# Altium project Zumo LF v2.0.PrjPcb (part 1 of 3)
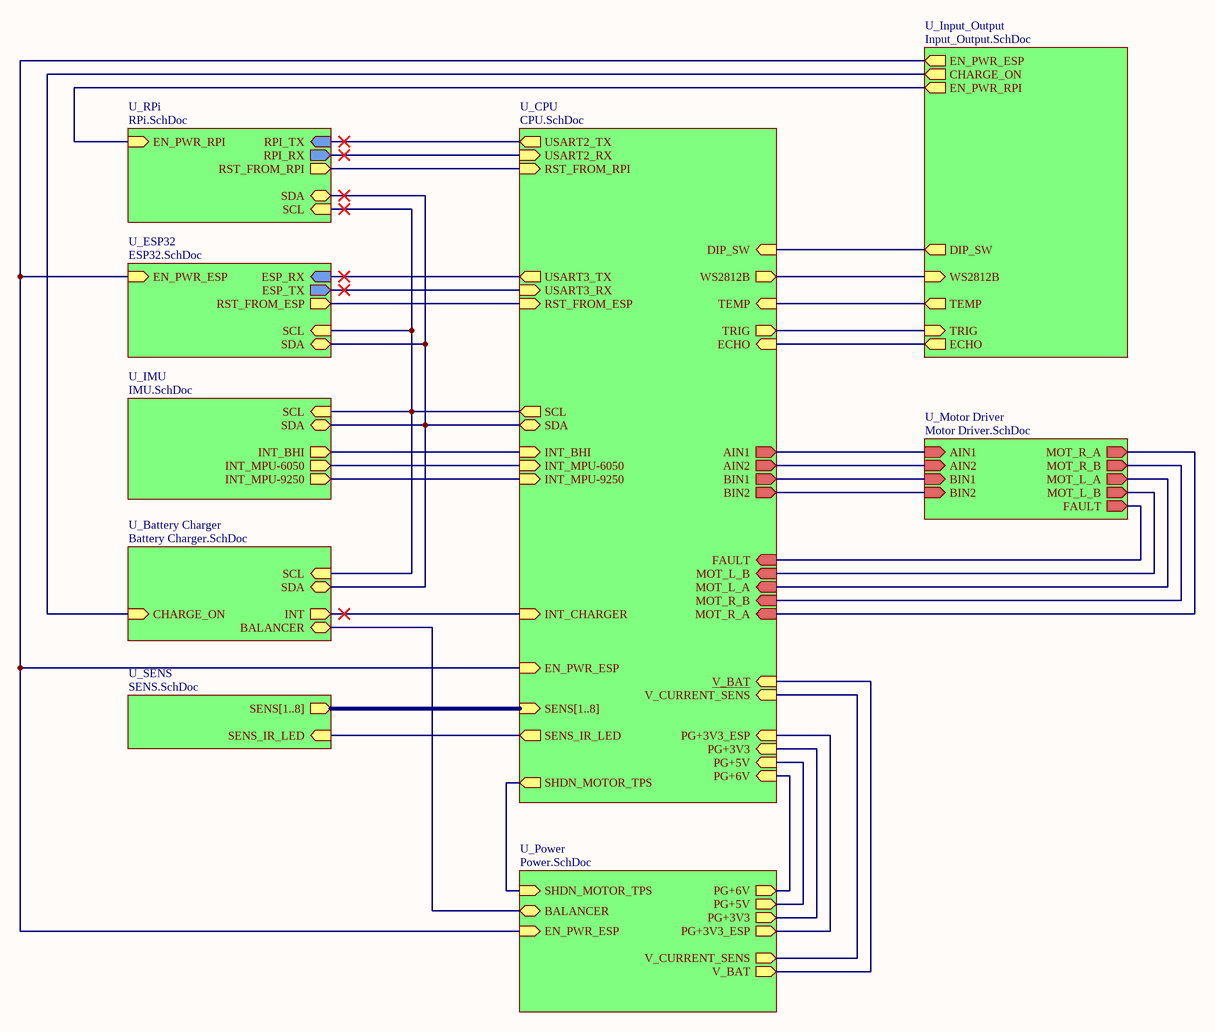
[diagram p0: Main.SchDoc]
10 sheets, 191 parts. Net scope: hierarchical (ports join the sheet entries above them; power ports are global).
Board file: Zumo LF v2.0.PcbDoc
Sheets:
  Main.SchDoc
    U_SENS = SENS.SchDoc
    U_Power = Power.SchDoc
    U_Motor Driver = Motor Driver.SchDoc
    U_CPU = CPU.SchDoc
    U_IMU = IMU.SchDoc
    U_ESP32 = ESP32.SchDoc
    U_RPi = RPi.SchDoc
    U_Input_Output = Input_Output.SchDoc
    U_Battery Charger = Battery Charger.SchDoc

## Sheet Main.SchDoc: Linefollower-Main
size A3; Author: Patryk Bujak; DrawnBy: Patryk Bujak; DocumentNumber: 12; Revision: 1.0; SheetNumber: 1; SheetTotal: 10

### Sub-sheets
U_Battery Charger = Battery Charger.SchDoc: SDA (bidir), SCL (in), CHARGE_ON (in), INT (out), BALANCER (bidir)
U_CPU = CPU.SchDoc: SENS[1..8] (in), SCL (out), SDA (bidir), INT_BHI (in), INT_MPU-9250 (in), INT_MPU-6050 (in), AIN2 (out), AIN1 (out), BIN1 (out), BIN2 (out), FAULT (in), MOT_R_B (in), MOT_R_A (in), MOT_L_B (in), MOT_L_A (in), SHDN_MOTOR_TPS (out), PG+3V3_ESP (in), PG+6V (in), PG+5V (in), PG+3V3 (in), SENS_IR_LED (out), TRIG (out), ECHO (in), TEMP (in), WS2812B (out), DIP_SW (in), V_CURRENT_SENS (in), V_BAT (in), EN_PWR_ESP (in), INT_CHARGER (in), RST_FROM_ESP (in), RST_FROM_RPI (in), USART2_TX (out), USART2_RX (in), USART3_RX (in), USART3_TX (out)
U_ESP32 = ESP32.SchDoc: ESP_TX (out), ESP_RX (in), EN_PWR_ESP (in), SDA (bidir), SCL (in), RST_FROM_ESP (out)
U_IMU = IMU.SchDoc: INT_BHI (out), INT_MPU-9250 (out), INT_MPU-6050 (out), SCL (in), SDA (bidir)
U_Input_Output = Input_Output.SchDoc: WS2812B (in), TRIG (in), ECHO (out), TEMP (out), CHARGE_ON (out), DIP_SW (out), EN_PWR_ESP (out), EN_PWR_RPI (out)
U_Motor Driver = Motor Driver.SchDoc: AIN2 (in), AIN1 (in), BIN1 (in), BIN2 (in), FAULT (out), MOT_R_B (out), MOT_R_A (out), MOT_L_B (out), MOT_L_A (out)
U_Power = Power.SchDoc: SHDN_MOTOR_TPS (in), PG+6V (out), PG+5V (out), PG+3V3 (out), PG+3V3_ESP (out), EN_PWR_ESP (in), V_CURRENT_SENS (out), V_BAT (out), BALANCER (bidir)
U_RPi = RPi.SchDoc: RPI_TX (in), RPI_RX (out), SDA (bidir), SCL (in), EN_PWR_RPI (in), RST_FROM_RPI (out)
U_SENS = SENS.SchDoc: SENS[1..8] (out), SENS_IR_LED (in)

### Nets
BCM2/SDA: sheet U_CPU/SDA, sheet U_IMU/SDA, sheet U_ESP32/SDA, sheet U_RPi/SDA, sheet U_Battery Charger/SDA
BCM3/SCL: sheet U_CPU/SCL, sheet U_IMU/SCL, sheet U_ESP32/SCL, sheet U_RPi/SCL, sheet U_Battery Charger/SCL
EN_PWR_RPI: sheet U_RPi/EN_PWR_RPI, sheet U_Input_Output/EN_PWR_RPI
PG+3V3: sheet U_Power/PG+3V3, sheet U_CPU/PG+3V3
PG+3V3_ESP: sheet U_Power/PG+3V3_ESP, sheet U_CPU/PG+3V3_ESP
PG+5V: sheet U_Power/PG+5V, sheet U_CPU/PG+5V
PG+6V: sheet U_Power/PG+6V, sheet U_CPU/PG+6V
RXD: sheet U_CPU/USART3_TX, sheet U_ESP32/ESP_RX
TXD: sheet U_CPU/USART3_RX, sheet U_ESP32/ESP_TX
WS2812B: sheet U_CPU/WS2812B, sheet U_Input_Output/WS2812B
NetC4_1: sheet U_CPU/TEMP, sheet U_Input_Output/TEMP
NetC6_1: sheet U_Power/V_CURRENT_SENS, sheet U_CPU/V_CURRENT_SENS
NetC22_1: sheet U_Power/V_BAT, sheet U_CPU/V_BAT
NetD8_1: sheet U_Motor Driver/FAULT, sheet U_CPU/FAULT
NetJ1_2: sheet U_Power/BALANCER, sheet U_Battery Charger/BALANCER
NetJ4_11: sheet U_SENS/SENS_IR_LED, sheet U_CPU/SENS_IR_LED
NetM1_24: sheet U_CPU/RST_FROM_ESP, sheet U_ESP32/RST_FROM_ESP
NetP4_4: sheet U_Motor Driver/MOT_L_A, sheet U_CPU/MOT_L_A
NetP4_5: sheet U_Motor Driver/MOT_L_B, sheet U_CPU/MOT_L_B
NetP5_4: sheet U_Motor Driver/MOT_R_A, sheet U_CPU/MOT_R_A
NetP5_5: sheet U_Motor Driver/MOT_R_B, sheet U_CPU/MOT_R_B
NetR7_1: sheet U_Power/SHDN_MOTOR_TPS, sheet U_CPU/SHDN_MOTOR_TPS
NetR10_2: sheet U_CPU/RST_FROM_RPI, sheet U_RPi/RST_FROM_RPI
NetR11_2: sheet U_Power/EN_PWR_ESP, sheet U_CPU/EN_PWR_ESP, sheet U_ESP32/EN_PWR_ESP, sheet U_Input_Output/EN_PWR_ESP
NetR60_1: sheet U_CPU/INT_CHARGER, sheet U_Battery Charger/INT
NetR61_1: sheet U_Input_Output/CHARGE_ON, sheet U_Battery Charger/CHARGE_ON
NetS1_7: sheet U_CPU/DIP_SW, sheet U_Input_Output/DIP_SW
NetU7_24: sheet U_CPU/INT_MPU-6050, sheet U_IMU/INT_MPU-6050
NetU7_26: sheet U_Motor Driver/AIN1, sheet U_CPU/AIN1
NetU7_27: sheet U_Motor Driver/AIN2, sheet U_CPU/AIN2
NetU7_29: sheet U_CPU/TRIG, sheet U_Input_Output/TRIG
NetU7_30: sheet U_CPU/ECHO, sheet U_Input_Output/ECHO
NetU7_34: sheet U_Motor Driver/BIN1, sheet U_CPU/BIN1
NetU7_35: sheet U_Motor Driver/BIN2, sheet U_CPU/BIN2
NetU7_53: sheet U_CPU/INT_BHI, sheet U_IMU/INT_BHI
NetU7_54: sheet U_CPU/INT_MPU-9250, sheet U_IMU/INT_MPU-9250
NetU7_55: sheet U_CPU/USART2_TX, sheet U_RPi/RPI_TX
NetU7_56: sheet U_CPU/USART2_RX, sheet U_RPi/RPI_RX

### Buses and harness runs
bus sheet U_CPU/SENS[1..8] = sheet U_SENS/SENS[1..8]

### Notes on the sheet
- Title:
- Sheet:
- of
- Author:
- Model:
- Document Number:
- Checked by:
- Iss-Rev:
- Approved by:
- Date:
- File name:

## Sheet SENS.SchDoc: Motherboard-SENS
size A4; Author: Patryk Bujak; DrawnBy: Patryk Bujak; DocumentNumber: 12; Revision: 1.0; SheetNumber: 2; SheetTotal: 10
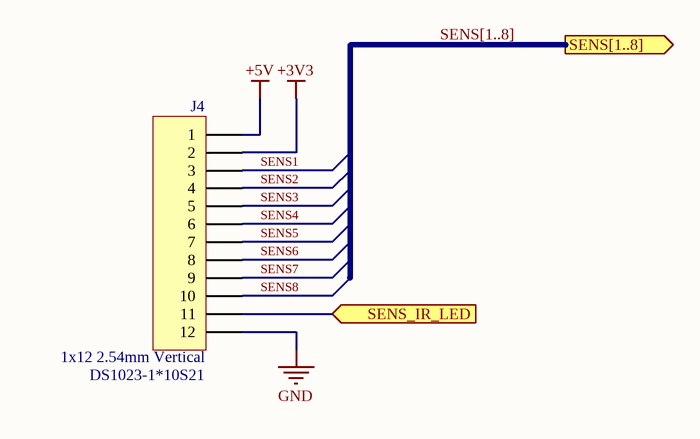
[diagram p1: SENS.SchDoc]

### Parts
J4  value DS1023-1*10S21  SCH_Footprint: 1x12 2.54mm Vertical  [J_HEADER_1x12_2.54_VERTICAL]  (hidden comment: Goldpin female straight)

### Ports
SENS[1..8] (out), SENS_IR_LED (in)

### Nets
+3V3: J4.2
+5V: J4.1
GND: J4.12
SENS1: J4.3
SENS2: J4.4
SENS3: J4.5
SENS4: J4.6
SENS5: J4.7
SENS6: J4.8
SENS7: J4.9
SENS8: J4.10
NetJ4_11: J4.11 ; port SENS_IR_LED

### Buses and harness runs
bus SENS[1..8] = port SENS[1..8]

### Notes on the sheet
- Title:
- Sheet:
- of
- Author:
- Model:
- Document Number:
- Checked by:
- Iss-Rev:
- Approved by:
- Date:
- File name:

### Library data of the parts
J4 = J_HEADER_1x12_2.54_VERTICAL: Header, 12-Pin; Manufacturer: Connfly; Part Number: J_HEADER_1x12_2.54_VERTICAL; Component Type: Standard; HelpURL: https://www.tme.eu/Document/efd0203e2d3a140765df98191085ea88/DS1023.pdf; Manufacturer Part Number: DS1023-1*10S21; Supplier 1: TME; Supplier Part Number 1: ZL262-10SG; Supplier 2: RS Components; Supplier 3: Farnell; Supplier 4: Mouser; Supplier 5: Digi-Key

## Sheet Power.SchDoc: Linefollower-Power
size A3; Author: Patryk Bujak; DrawnBy: Patryk Bujak; DocumentNumber: 12; Revision: 1.0; SheetNumber: 10; SheetTotal: 10
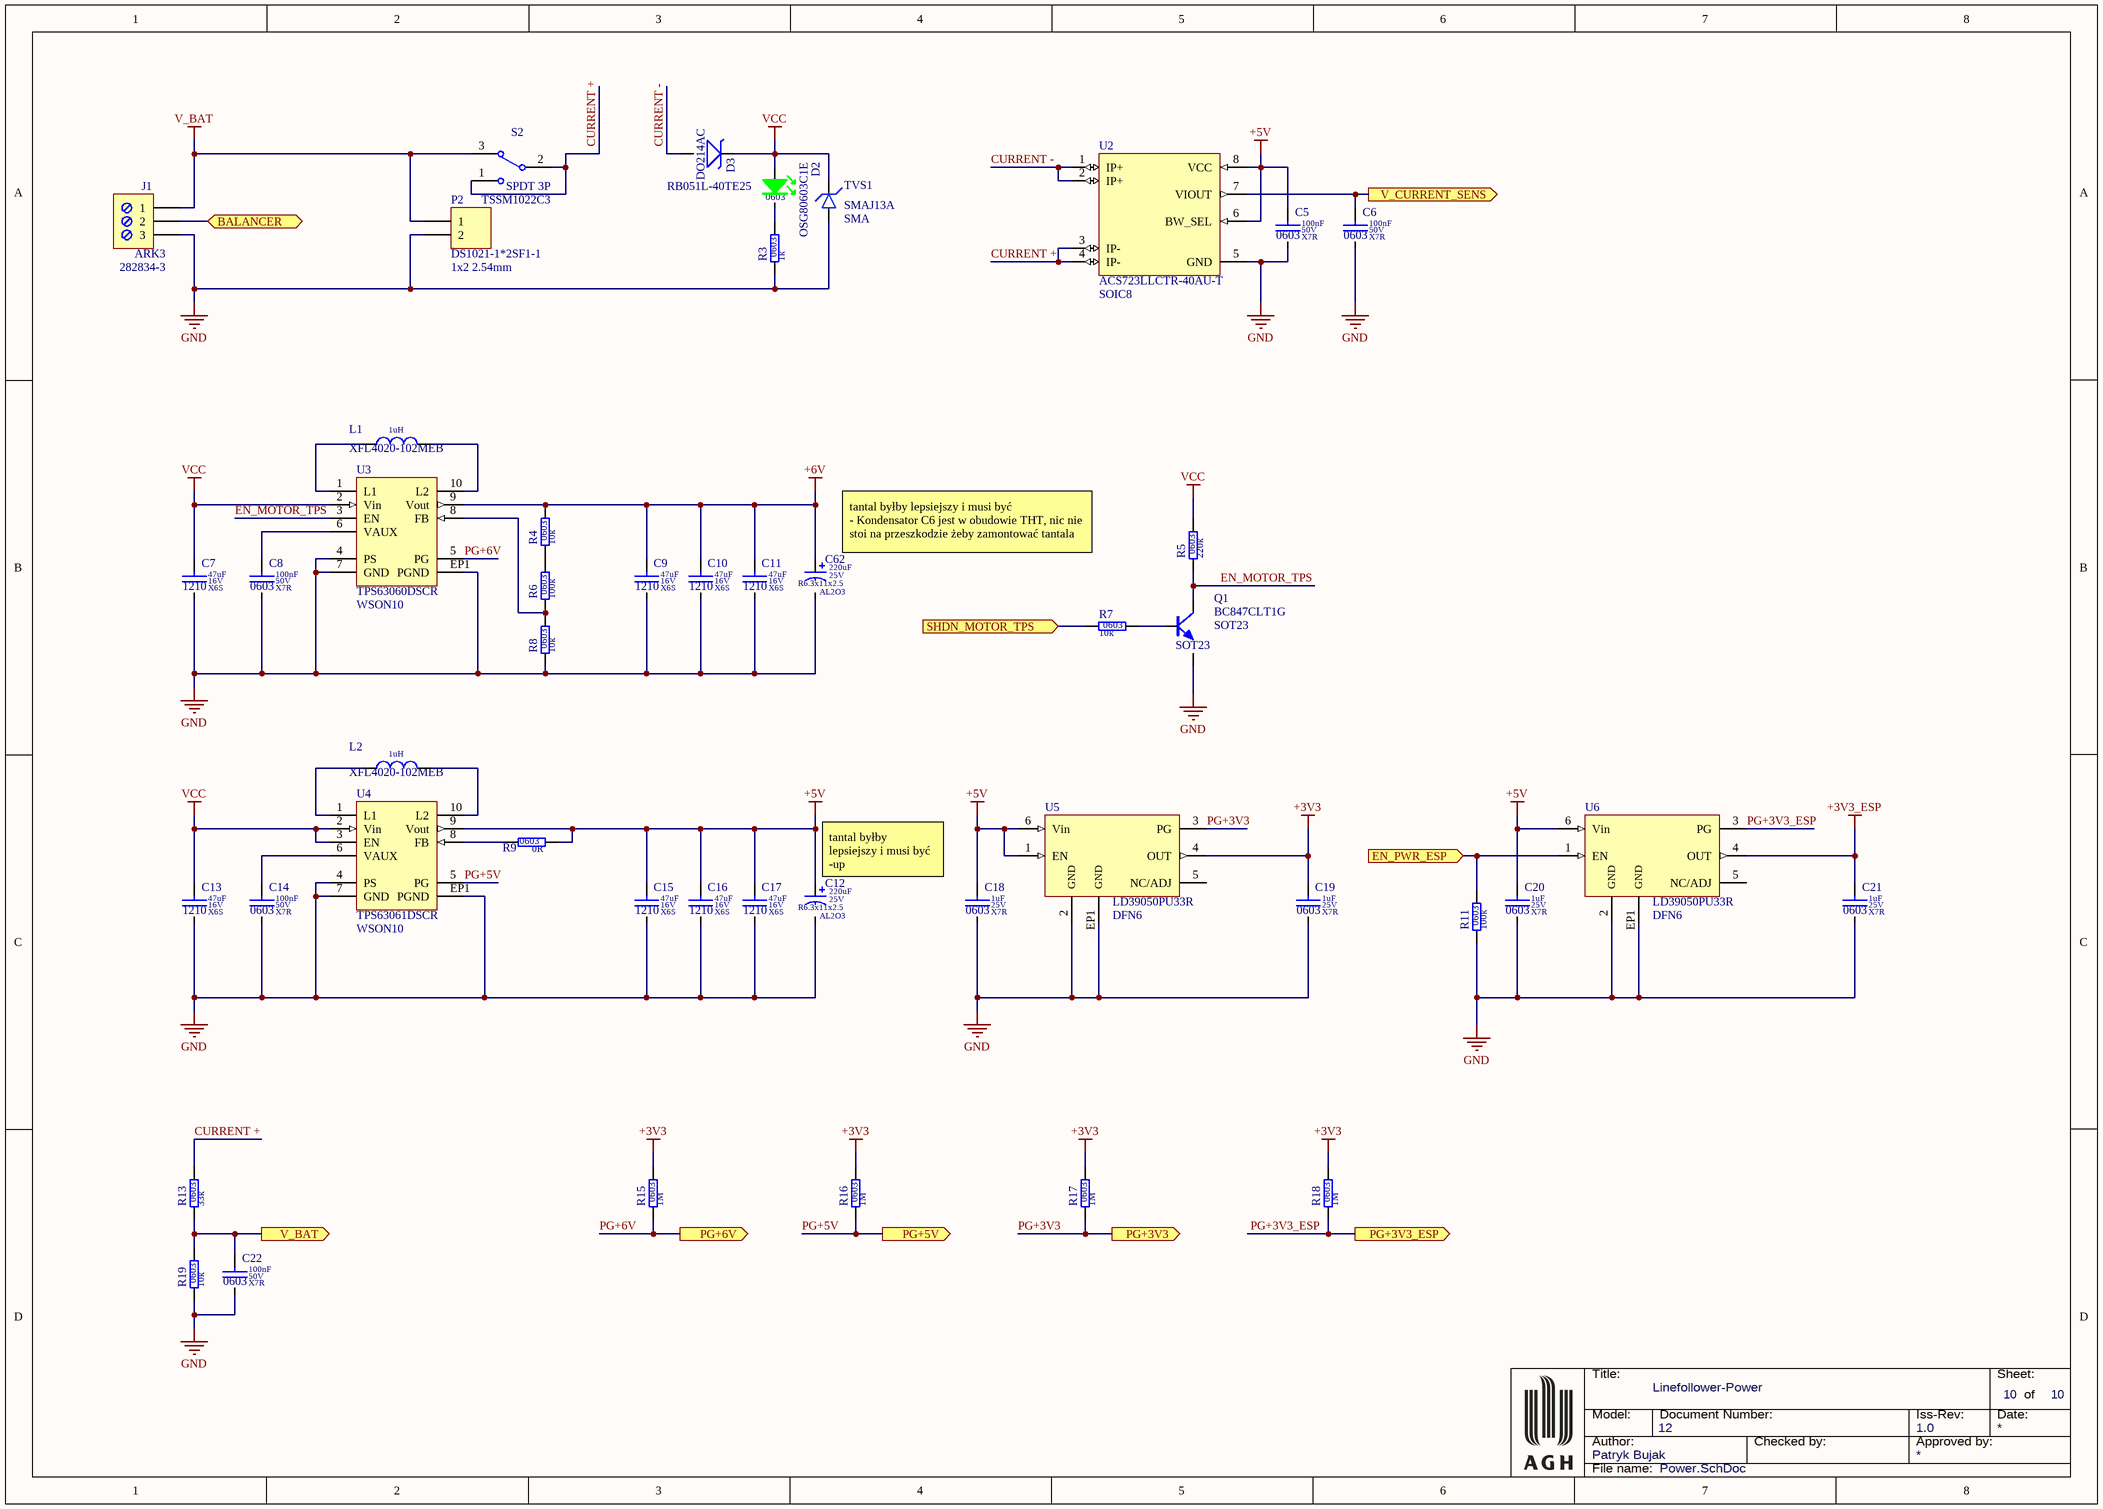
[diagram p2: Power.SchDoc]

### Parts
C5  value 100nF  Dielectric: X7R  Voltage: 50V  SCH_Footprint: 0603  [C_0603_1608]  (hidden comment: Ceramic X7R)
C6  value 100nF  Dielectric: X7R  Voltage: 50V  SCH_Footprint: 0603  [C_0603_1608]  (hidden comment: Ceramic X7R)
C7  value 47uF  Dielectric: X6S  Voltage: 16V  SCH_Footprint: 1210  [C_1210_3225]  (hidden comment: Ceramic X6S)
C8  value 100nF  Dielectric: X7R  Voltage: 50V  SCH_Footprint: 0603  [C_0603_1608]  (hidden comment: Ceramic X7R)
C9  value 47uF  Dielectric: X6S  Voltage: 16V  SCH_Footprint: 1210  [C_1210_3225]  (hidden comment: Ceramic X6S)
C10  value 47uF  Dielectric: X6S  Voltage: 16V  SCH_Footprint: 1210  [C_1210_3225]  (hidden comment: Ceramic X6S)
C11  value 47uF  Dielectric: X6S  Voltage: 16V  SCH_Footprint: 1210  [C_1210_3225]  (hidden comment: Ceramic X6S)
C12  value 220uF  Dielectric: AL2O3  SCH_Footprint: R6.3x11x2.5  Voltage: 25V  [C_R6.3x11x2.5]  (hidden comment: Electrolytic Capacitor)
C13  value 47uF  Dielectric: X6S  Voltage: 16V  SCH_Footprint: 1210  [C_1210_3225]  (hidden comment: Ceramic X6S)
C14  value 100nF  Dielectric: X7R  Voltage: 50V  SCH_Footprint: 0603  [C_0603_1608]  (hidden comment: Ceramic X7R)
C15  value 47uF  Dielectric: X6S  Voltage: 16V  SCH_Footprint: 1210  [C_1210_3225]  (hidden comment: Ceramic X6S)
C16  value 47uF  Dielectric: X6S  Voltage: 16V  SCH_Footprint: 1210  [C_1210_3225]  (hidden comment: Ceramic X6S)
C17  value 47uF  Dielectric: X6S  Voltage: 16V  SCH_Footprint: 1210  [C_1210_3225]  (hidden comment: Ceramic X6S)
C18  value 1uF  Dielectric: X7R  Voltage: 25V  SCH_Footprint: 0603  [C_0603_1608]  (hidden comment: Ceramic X7R)
C19  value 1uF  Dielectric: X7R  Voltage: 25V  SCH_Footprint: 0603  [C_0603_1608]  (hidden comment: Ceramic X7R)
C20  value 1uF  Dielectric: X7R  Voltage: 25V  SCH_Footprint: 0603  [C_0603_1608]  (hidden comment: Ceramic X7R)
C21  value 1uF  Dielectric: X7R  Voltage: 25V  SCH_Footprint: 0603  [C_0603_1608]  (hidden comment: Ceramic X7R)
C22  value 100nF  Dielectric: X7R  Voltage: 50V  SCH_Footprint: 0603  [C_0603_1608]  (hidden comment: Ceramic X7R)
C62  value 220uF  Dielectric: AL2O3  SCH_Footprint: R6.3x11x2.5  Voltage: 25V  [C_R6.3x11x2.5]  (hidden comment: Electrolytic Capacitor)
D2  value OSG80603C1E  SCH_Footprint: 0603  [OL_0603_1608]  (hidden comment: Green led)
D3  SCH_Footprint: DO214AC  [SMA_DO-214AC]  (hidden comment: RB051L-40TE25)
J1  value 282834-3  [J_ARK3_2.54]  (hidden comment: ARK3)
L1  value 1uH  SCH_Footprint: XFL4020-102MEB  [XFL4020]  (hidden comment: Inductor)
L2  value 1uH  SCH_Footprint: XFL4020-102MEB  [XFL4020]  (hidden comment: Inductor)
P2  value DS1021-1*2SF1-1  SCH_Footprint: 1x2 2.54mm  [P_HEADER_1x2_2.54]  (hidden comment: Goldpin)
Q1  value BC847CLT1G  SCH_Footprint: SOT23  [SOT23_TO236_SC59]  (hidden comment: BC847C)
R3  value 1k  SCH_Footprint: 0603  [R_0603_1608]  (hidden comment: Resistor)
R4  value 10k  SCH_Footprint: 0603  [R_0603_1608]  (hidden comment: Resistor)
R5  value 220k  SCH_Footprint: 0603  [R_0603_1608]  (hidden comment: Resistor)
R6  value 100k  SCH_Footprint: 0603  [R_0603_1608]  (hidden comment: Resistor)
R7  value 10k  SCH_Footprint: 0603  [R_0603_1608]  (hidden comment: Resistor)
R8  value 10k  SCH_Footprint: 0603  [R_0603_1608]  (hidden comment: Resistor)
R9  value 0R  SCH_Footprint: 0603  [R_0603_1608]  (hidden comment: Resistor)
R11  value 100k  SCH_Footprint: 0603  [R_0603_1608]  (hidden comment: Resistor)
R13  value 33k  SCH_Footprint: 0603  [R_0603_1608]  (hidden comment: Resistor)
R15  value 1M  SCH_Footprint: 0603  [R_0603_1608]  (hidden comment: Resistor)
R16  value 1M  SCH_Footprint: 0603  [R_0603_1608]  (hidden comment: Resistor)
R17  value 1M  SCH_Footprint: 0603  [R_0603_1608]  (hidden comment: Resistor)
R18  value 1M  SCH_Footprint: 0603  [R_0603_1608]  (hidden comment: Resistor)
R19  value 10k  SCH_Footprint: 0603  [R_0603_1608]  (hidden comment: Resistor)
S2  value TSSM1022C3  SCH_Footprint: SPDT 3P  [SPDT_3P]  (hidden comment: ON-ON Subminiature Toggle Switch, Right Angle Mounting, Vertical Actuation)
TVS1  value SMAJ13A  SCH_Footprint: SMA  [SMA_DO-214AC]  (hidden comment: TVS Unidirectional)
U2  value ACS723LLCTR-40AU-T  SCH_Footprint: SOIC8  [SOP8_SO8_SOIC8_4X5X18]  (hidden comment: Hall unidirectional current sensor)
U3  value TPS63060DSCR  SCH_Footprint: WSON10  [WSON10_3x3]  (hidden comment: TPS63060)
U4  value TPS63061DSCR  SCH_Footprint: WSON10  [WSON10_3x3]  (hidden comment: TPS63061)
U5  SCH_Footprint: DFN6  [DFN6_3x3]  (hidden comment: LD39050PU33R)
U6  SCH_Footprint: DFN6  [DFN6_3x3]  (hidden comment: LD39050PU33R)

### Ports
BALANCER (bidir), EN_PWR_ESP (in), PG+3V3 (out), PG+3V3_ESP (out), PG+5V (out), PG+6V (out), SHDN_MOTOR_TPS (in), V_BAT (out), V_CURRENT_SENS (out)

### Nets
+3V3: C19.1 R15.2 R16.2 R17.2 R18.2 U5.4(OUT)
+3V3_ESP: C21.1 U6.4(OUT)
+5V: C5.1 C12.1 C15.1 C16.1 C17.1 C18.1 C20.1 R9.1 U2.6(BW_SEL) U2.8(VCC) U4.9(Vout) U5.1(EN) U5.6(Vin) U6.6(Vin)
+6V: C9.1 C10.1 C11.1 C62.1 R4.2 U3.9(Vout)
GND: C5.2 C6.2 C7.2 C8.2 C9.2 C10.2 C11.2 C12.2 C13.2 C14.2 C15.2 C16.2 C17.2 C18.2 C19.2 C20.2 C21.2 C22.2 C62.2 J1.3 P2.2 Q1.2(E) R3.1 R8.1 R11.1 R19.1 TVS1.2 U2.5(GND) U3.4(PS) U3.7(GND) U3.EP1(PGND) U4.4(PS) U4.7(GND) U4.EP1(PGND) U5.2(GND) U5.EP1(GND) U6.2(GND) U6.EP1(GND)
V_BAT: J1.1 P2.1 S2.3
VCC: C7.1 C13.1 D2.2(A) D3.1 R5.2 TVS1.1 U3.2(Vin) U4.2(Vin) U4.3(EN)
CURRENT +: R13.2 S2.1 S2.2 U2.3(IP-) U2.4(IP-)
CURRENT -: D3.2 U2.1(IP+) U2.2(IP+)
EN_MOTOR_TPS: Q1.3(C) R5.1 U3.3(EN)
PG+3V3: R17.1 U5.3(PG) ; port PG+3V3
PG+3V3_ESP: R18.1 U6.3(PG) ; port PG+3V3_ESP
PG+5V: R16.1 U4.5(PG) ; port PG+5V
PG+6V: R15.1 U3.5(PG) ; port PG+6V
NetC6_1: C6.1 U2.7(VIOUT) ; port V_CURRENT_SENS
NetC8_1: C8.1 U3.6(VAUX)
NetC14_1: C14.1 U4.6(VAUX)
NetC22_1: C22.1 R13.1 R19.2 ; port V_BAT
NetD2_1: D2.1(K) R3.2
NetJ1_2: J1.2 ; port BALANCER
NetL1_1: L1.1 U3.1(L1)
NetL1_2: L1.2 U3.10(L2)
NetL2_1: L2.1 U4.1(L1)
NetL2_2: L2.2 U4.10(L2)
NetQ1_1: Q1.1(B) R7.2
NetR4_1: R4.1 R6.2
NetR6_1: R6.1 R8.2 U3.8(FB)
NetR7_1: R7.1 ; port SHDN_MOTOR_TPS
NetR9_2: R9.2 U4.8(FB)
NetR11_2: R11.2 U6.1(EN) ; port EN_PWR_ESP

Not connected (* = marked no-connect by the designer): U5 5(NC/ADJ); U6 5(NC/ADJ)

### Notes on the sheet
- (near C62) tantal byłby lepsiejszy i musi być
  - Kondensator C6 jest w obudowie THT, nic nie stoi na przeszkodzie żeby zamontować tantala
- (near C12) tantal byłby lepsiejszy i musi być
  -up
- Title:
- Sheet:
- of
- Author:
- Model:
- Document Number:
- Checked by:
- Iss-Rev:
- Approved by:
- Date:
- File name:

### Library data of the parts
C5 C6 C8 C14 C22 = C_100nF_50V_X7R_0603_5: Capacitor; Manufacturer: Samsung; Manufacturer Part Number: CL10B104JB8NNNC; Tolerance (%): 5; Part Number: C_100nF_50V_X7R_0603_5; HelpURL: http://www.tme.eu/pl/Document/4a42202b32dab16128fe107dd69598cc/samsung-chip-cap.pdf; Supplier 1: TME; Supplier Part Number 1: CL10B104JB8NNNC; Supplier 2: RS Components; Supplier 3: Farnell; Supplier 4: Mouser; Supplier 5: Digi-Key
C7 C9-C11 C13 C15-C17 = C_47uF_16V_X6S_1210_10: Capacitor; Manufacturer: Murata; Manufacturer Part Number: GRM32EC81C476KE15L; Tolerance (%): 10; Part Number: C_47uF_16V_X6S_1210_10; HelpURL: https://datasheet.octopart.com/GRM32EC81C476KE15L-Murata-datasheet-138746852.pdf; Supplier 1: TME; Supplier 2: RS Components; Supplier Part Number 2: 8467369; Supplier 3: Farnell; Supplier Part Number 3: 1907527; Supplier 4: Mouser; Supplier Part Number 4: 81-GRM32EC81C476KE5L; Supplier 5: Digi-Key; Supplier Part Number 5: 490-10531-1-ND
C12 C62 = CE_220uF_25V_6.3x11x2.5_LESR_20: Polarized Capacitor; Manufacturer: Samxon; Manufacturer Part Number: GF 220U/25V; Tolerance (%): 20; Part Number: CE_220uF_25V_6.3x11x2.5_LESR_20; HelpURL: http://www.tme.eu/pl/Document/9fe41abe6e7b7973ea4089f212d099cc/E-GF_series.pdf; Supplier 1: TME; Supplier Part Number 1: GF220/25; Supplier 2: RS Components; Supplier 3: Farnell; Supplier 4: Mouser; Supplier 5: Digi-Key
C18-C21 = C_1uF_25V_X7R_0603_10: Capacitor; Manufacturer: Samsung; Manufacturer Part Number: CL10B105KA8NNNC; Tolerance (%): 10; Part Number: C_1uF_25V_X7R_0603_10; HelpURL: http://www.tme.eu/pl/Document/4a42202b32dab16128fe107dd69598cc/samsung-chip-cap.pdf; Supplier 1: TME; Supplier Part Number 1: CL10B105KA8NNNC; Supplier 2: RS Components; Supplier 3: Farnell; Supplier 4: Mouser; Supplier 5: Digi-Key
D2 = OL_G_0603_OSG80603C1E: LED GREEN; Manufacturer: Optosupply; Part Number: OL_G_0603_OSG80603C1E; Manufacturer Part Number: OSG80603C1E; Supplier 1: TME; Supplier Part Number 1: OSG80603C1E; Supplier 2: RS Components; Supplier 3: Farnell; Supplier 4: Mouser; Supplier 5: Digi-Key
D3 = DS_RB051L-40TE25_3A_20V_SMA: Manufacturer: Rohm; Current: 3A; Value: RB051L-40TE25; Part Number: DS_RB051L-40TE25_3A_20V_SMA; HelpURL: https://www.tme.eu/Document/ad2965130a92e364f1d92d949ed8cf88/RB051L-40TE25.pdf; Manufacturer Part Number: RB051L-40TE25; Supplier 1: TME; Supplier Part Number 1: RB051L-40TE25; Supplier 2: RS Components; Supplier Part Number 2: 2636897P; Supplier 3: Farnell; Supplier Part Number 3: 1680016; Supplier 4: Mouser; Supplier 5: Digi-Key; Supplier Part Number 5: RB051L-40TE25TR-ND
J1 = J_282834-3: ARK Screw terminal, 3-Pin; Manufacturer: TE Connectivity; SCH_Footprint: ARK3; Part Number: J_282834-3; Component Type: Standard; HelpURL: https://www.te.com/commerce/DocumentDelivery/DDEController?Action=showdoc&DocId=Catalog+Section%7F1308389_EUROSTYLE_TERMINAL_BLOCKS%7F0607%7Fpdf%7FEnglish%7FENG_CS_1308389_EUROSTYLE_TERMINAL_BLOCKS_0607.pdf%7F282834-3; Manufacturer Part Number: 282834-3; Supplier 1: TME; Supplier Part Number 1: 282834-3; Supplier 2: RS Components; Supplier Part Number 2: 717-6634; Supplier 3: Farnell; Supplier Part Number 3: 2396254; Supplier 4: Mouser; Supplier Part Number 4: 571-2828343; Supplier 5: Digi-Key; Supplier Part Number 5: A98334-ND
L1 L2 = LM_1uH_11A_XFL4020-102MEB: Induction; Manufacturer: Coilcraft; Current: 11A; Resistance: 11.9mR; Part Number: LM_1uH_11A_XFL4020-102MEB; HelpURL: https://datasheet.octopart.com/XFL4020-102MEB-Coilcraft-datasheet-10792328.pdf; Manufacturer Part Number: XFL4020-102MEB; Supplier 1: TME; Supplier 2: RS Components; Supplier 3: Farnell; Supplier 4: Mouser; Supplier Part Number 4: 994-XFL4020-102MEB; Supplier 5: Digi-Key; Supplier 6: Coilcfrat; Supplier Part Number 6: XFL4020-102MEB
P2 = P_HEADER_1x2_2.54: Header, 2-Pin; Manufacturer: Connfly; Part Number: P_HEADER_1x2_2.54; Component Type: Standard; HelpURL: http://www.tme.eu/en/Document/cc301e58a5da78cb543a94b5a5b7f06a/DS1021.pdf; Manufacturer Part Number: DS1021-1*2SF1-1; Supplier 1: TME; Supplier Part Number 1: ZL201-02G; Supplier 2: RS Components; Supplier 3: Farnell; Supplier 4: Mouser; Supplier 5: Digi-Key
Q1 = QNP_BC847C_45V_0A1: Manufacturer: ON Semiconductor; Type: NPN; Voltage: 45V; Current: 0A1; Part Number: QNP_BC847C_45V_0A1; HelpURL: https://assets.nexperia.com/documents/data-sheet/BC847_SER.pdf; Manufacturer Part Number: BC847CLT1G; Supplier 1: TME; Supplier Part Number 1: BC847CLT1G; Supplier 2: RS Components; Supplier 3: Farnell; Supplier 4: Mouser; Supplier 5: Digi-Key; Supplier Part Number 5: BC847CLT1GOSCT-ND
R3 = R_1k_0603_1: Manufacturer: Vishay; Manufacturer Part Number: CRCW06031K00FKEA; Voltage: 75V; Power: 100mW; Tolerance: 1%; Part Number: R_1k_0603_1; HelpURL: http://www.farnell.com/datasheets/2310790.pdf?_ga=2.256888843.1690599162.1548417389-1379097396.1542296996&_gac=1.262631934.1547230258.Cj0KCQiAmuHhBRD0ARIsAFWyPwhX8HcvXnM3tA0ZBodZLzDIjH2ZxLpjT5LWo9bad_HPRbU8LfPq44UaAhEwEALw_wcB; Supplier 1: TME; Supplier 2: RS Components; Supplier Part Number 2: 678-9875P; Supplier 3: Farnell; Supplier Part Number 3: 1469740; Supplier 4: Mouser; Supplier Part Number 4: 71-CRCW0603-1.0K-E3; Supplier 5: Digi-Key; Supplier Part Number 5: 541-1.00KHCT-ND
R4 R7 R8 R19 = R_10k_0603_1: Manufacturer: Vishay; Manufacturer Part Number: CRCW060310K0FKTABC; Voltage: 75V; Power: 100mW; Tolerance: 1%; Part Number: R_10k_0603_1; HelpURL: http://www.tme.eu/pl/Document/622e28308c06d160637f2b14751ba16b/Data%20Sheet%20CRCW_BCe3.pdf; Supplier 1: TME; Supplier Part Number 1: CRCW060310K0FKTABC; Supplier 2: RS Components; Supplier 3: Farnell; Supplier 4: Mouser; Supplier Part Number 4: 667-ERJ-3EKF1002V; Supplier 5: Digi-Key; Supplier Part Number 5: P10KGCT-ND
R5 = R_220k_0603_1: Manufacturer: Vishay; Manufacturer Part Number: CRCW0603220KFKTABC; Voltage: 75V; Power: 100mW; Tolerance: 1%; Part Number: R_220k_0603_1; HelpURL: https://www.tme.eu/Document/622e28308c06d160637f2b14751ba16b/Data%20Sheet%20CRCW_BCe3.pdf; Supplier 1: TME; Supplier Part Number 1: CRCW0603220KFKTABC; Supplier 2: RS Components; Supplier 3: Farnell; Supplier 4: Mouser; Supplier 5: Digi-Key
R6 R11 = R_100k_0603_1: Manufacturer: Royalohm; Manufacturer Part Number: 0603SAF1003T5E; Voltage: 50V; Power: 100mW; Tolerance: 1%; Part Number: R_100k_0603_1; HelpURL: http://www.tme.eu/pl/Document/b315665a56acbc42df513c99b390ad98/ROYALOHM-THICKFILM.pdf; Supplier 1: TME; Supplier Part Number 1: SMD0603-100K-1%; Supplier 2: RS Components; Supplier 3: Farnell; Supplier 4: Mouser; Supplier Part Number 4: 667-ERJ-3EKF1003V; Supplier 5: Digi-Key; Supplier Part Number 5: P100KHCT-ND
R9 = R_0R_0603_5: Manufacturer: Samsung; Manufacturer Part Number: RC1608J000CS; Voltage: 50V; Power: 100mW; Tolerance: 5%; Part Number: R_0R_0603_5; HelpURL: http://www.samsungsem.com/kr/support/product-search/chip-resistor/RC1608J000CS.jsp; Supplier 1: TME; Supplier 2: RS Components; Supplier 3: Farnell; Supplier 4: Mouser; Supplier 5: Digi-Key; Supplier Part Number 5: 1276-3510-1-ND
R13 = R_33k_0603_1: Manufacturer: Vishay; Manufacturer Part Number: CRCW060333K0FKTABC; Voltage: 75V; Power: 100mW; Tolerance: 1%; Part Number: R_33k_0603_1; HelpURL: http://www.tme.eu/pl/Document/622e28308c06d160637f2b14751ba16b/Data%20Sheet%20CRCW_BCe3.pdf; Supplier 1: TME; Supplier Part Number 1: CRCW060333K0FKTABC; Supplier 2: RS Components; Supplier 3: Farnell; Supplier 4: Mouser; Supplier Part Number 4: 71-CRCW0603-33K; Supplier 5: Digi-Key
R15-R18 = R_1M_0603_1: Manufacturer: Bourns; Manufacturer Part Number: CR0603-FX-1004ELF; Voltage: 50V; Power: 100mW; Tolerance: 1%; Part Number: R_1M_0603_1; HelpURL: https://datasheet.octopart.com/CR0603-FX-1004ELF-Bourns-datasheet-5318152.pdf; Supplier 1: TME; Supplier 2: RS Components; Supplier 3: Farnell; Supplier Part Number 3: 2321755; Supplier 4: Mouser; Supplier Part Number 4: 652-CR0603FX-1004ELF; Supplier 5: Digi-Key; Supplier Part Number 5: CR0603-FX-1004ELFCT-ND
S2 = S_TSSM1022C3: Manufacturer: Ninigi; Part Number: S_TSSM1022C3; HelpURL: https://www.tme.eu/Document/30b7e6362e90fef2b4472b38492345f6/tssm102.pdf; Manufacturer Part Number: TSSM1022C3; Supplier 1: TME; Supplier Part Number 1: TSSM1022C3; Supplier 2: RS Components; Supplier 3: Farnell; Supplier 4: Mouser; Supplier 5: Digi-Key
TVS1 = TVS_SMAJ13A: Manufacturer: Littelfuse; Voltage: 15.15V; Current: 18.6A; Part Number: TVS_SMAJ13A; HelpURL: https://www.tme.eu/Document/dbc72d81c249fe51b6ab42300e8e06d0/SMAJ_ser.pdf; Manufacturer Part Number: SMAJ13A; Supplier 1: TME; Supplier Part Number 1: SMAJ13A-LF; Supplier 2: RS Components; Supplier 3: Farnell; Supplier Part Number 3: 2762813; Supplier 4: Mouser; Supplier Part Number 4: 576-SMAJ13A; Supplier 5: Digi-Key; Supplier Part Number 5: SMAJ13ALFCT-ND
U2 = U_ACS723LLCTR-40AU-T: Manufacturer: Allegro; Part Number: U_ACS723LLCTR-40AU-T; HelpURL: https://www.allegromicro.com/~/media/Files/Datasheets/ACS723-Datasheet.ashx?la=en&hash=1800BF05ABE975CB295D729784D3AEABF820A0DC; Manufacturer Part Number: ACS723LLCTR-40AU-T; Supplier 1: TME; Supplier 2: RS Components; Supplier 3: Farnell; Supplier 4: Mouser; Supplier 5: Digi-Key; Supplier Part Number 5: 620-1647-1-ND
U3 = VS_TPS63060DSC: Manufacturer: Texas Instruments; Frequency (kHz): 2400; Topology: Buck-Boost; Vin min (V): 2,5; Vin max (V): 12; Vout max (V): 8; Imax (A): 2; Iswitch (A): 0; Part Number: VS_TPS63060DSC; Vout min (V): 2,5; HelpURL: http://www.ti.com/lit/ds/symlink/tps63061.pdf; Manufacturer Part Number: TPS63060DSCR; Supplier 1: TME; Supplier 2: RS Components; Supplier 3: Farnell; Supplier Part Number 3: 2459493; Supplier 4: Mouser; Supplier Part Number 4: 595-TPS63060DSCR; Supplier 5: Digi-Key; Supplier Part Number 5: 296-30204-1-ND
U4 = VS_TPS63061DSC: Manufacturer: Texas Instruments; Frequency (kHz): 2400; Topology: Buck-Boost; Vin min (V): 2,5; Vin max (V): 12; Vout max (V): 8; Imax (A): 2; Iswitch (A): 0; Part Number: VS_TPS63061DSC; Vout min (V): 2,5; HelpURL: http://www.ti.com/lit/ds/symlink/tps63061.pdf; Manufacturer Part Number: TPS63061DSCR; Supplier 1: TME; Supplier 2: RS Components; Supplier Part Number 2: 121-9377; Supplier 3: Farnell; Supplier Part Number 3: 2082429; Supplier 4: Mouser; Supplier Part Number 4: 595-TPS63061DSCR; Supplier 5: Digi-Key; Supplier Part Number 5: 296-30205-1-ND
U5 U6 = VL_LD39050PU33R: Manufacturer: STMicroelectronics; Voltage: 3.3V; Current: 500mA; Value: LD39050PU33R; Part Number: VL_LD39050PU33R; HelpURL: https://www.tme.eu/pl/Document/062513da0f421ddb82a14a498f7bf1c8/LD39050.pdf; Manufacturer Part Number: LD39050PU33R; Supplier 1: TME; Supplier Part Number 1: LD39050PU33R; Supplier 2: RS Components; Supplier 3: Farnell; Supplier Part Number 3: 2762703; Supplier 4: Mouser; Supplier Part Number 4: 511-LD39050PU33R; Supplier 5: Digi-Key; Supplier Part Number 5: 497-8716-1-ND

## Sheet Motor Driver.SchDoc: Motherboard-Motor Driver
size A4; Author: Patryk Bujak; DrawnBy: Patryk Bujak; DocumentNumber: 12; Revision: 1.0; SheetNumber: 6; SheetTotal: 10
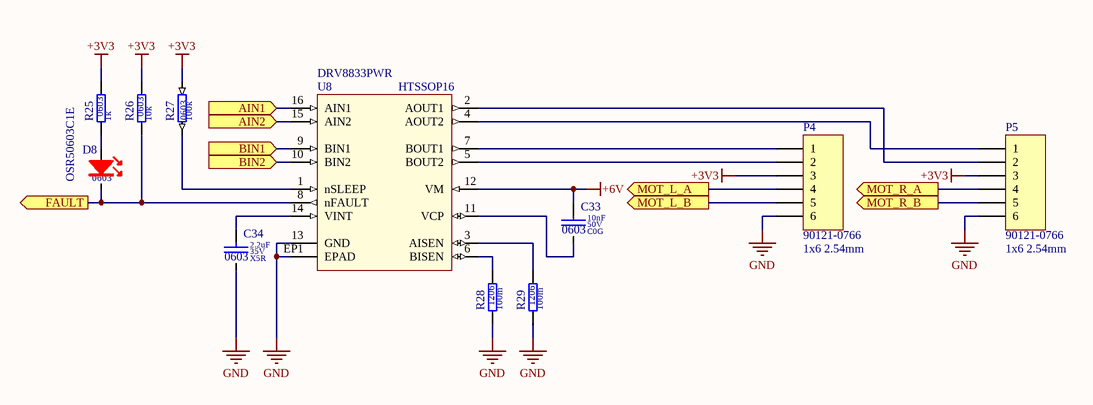
[diagram p3: Motor Driver.SchDoc]

### Parts
C33  value 10nF  Dielectric: C0G  Voltage: 50V  SCH_Footprint: 0603  [C_0603_1608]  (hidden comment: Ceramic C0G)
C34  value 2.2uF  Dielectric: X5R  Voltage: 35V  SCH_Footprint: 0603  [C_0603_1608]  (hidden comment: Ceramic X5R)
D8  value OSR50603C1E  SCH_Footprint: 0603  [OL_0603_1608]  (hidden comment: Red led)
P4  value 90121-0766  SCH_Footprint: 1x6 2.54mm  [P_HEADER_1x6_2.54_ANGLE]  (hidden comment: Goldpin)
P5  value 90121-0766  SCH_Footprint: 1x6 2.54mm  [P_HEADER_1x6_2.54_ANGLE]  (hidden comment: Goldpin)
R25  value 1k  SCH_Footprint: 0603  [R_0603_1608]  (hidden comment: Resistor)
R26  value 10k  SCH_Footprint: 0603  [R_0603_1608]  (hidden comment: Resistor)
R27  value 100k  SCH_Footprint: 0603  [R_0603_1608]  (hidden comment: Resistor)
R28  value 100m  SCH_Footprint: 1206  [R_1206_3216]  (hidden comment: Resistor)
R29  value 100m  SCH_Footprint: 1206  [R_1206_3216]  (hidden comment: Resistor)
U8  value DRV8833PWR  SCH_Footprint: HTSSOP16  [HTSSOP16_45x66x20_M]  (hidden comment: 2A Low Voltage Dual Brushed DC or Single Bipolar Stepper Motor Driver (PWM Ctrl))

### Ports
AIN1 (in), AIN2 (in), BIN1 (in), BIN2 (in), FAULT (out), MOT_L_A (out), MOT_L_B (out), MOT_R_A (out), MOT_R_B (out)

### Nets
+3V3: P4.3 P5.3 R25.2 R26.2 R27.1
+6V: C33.1 U8.12(VM)
GND: C34.2 P4.6 P5.6 R28.1 R29.1 U8.13(GND) U8.EP1(EPAD)
NetC33_2: C33.2 U8.11(VCP)
NetC34_1: C34.1 U8.14(VINT)
NetD8_1: D8.1(K) R26.1 U8.8(nFAULT) ; port FAULT
NetD8_2: D8.2(A) R25.1
NetP4_1: P4.1 U8.7(BOUT1)
NetP4_2: P4.2 U8.5(BOUT2)
NetP4_4: P4.4 ; port MOT_L_A
NetP4_5: P4.5 ; port MOT_L_B
NetP5_1: P5.1 U8.4(AOUT2)
NetP5_2: P5.2 U8.2(AOUT1)
NetP5_4: P5.4 ; port MOT_R_A
NetP5_5: P5.5 ; port MOT_R_B
NetR27_2: R27.2 U8.1(nSLEEP)
NetR28_2: R28.2 U8.6(BISEN)
NetR29_2: R29.2 U8.3(AISEN)
NetU7_26: U8.16(AIN1) ; port AIN1
NetU7_27: U8.15(AIN2) ; port AIN2
NetU7_34: U8.9(BIN1) ; port BIN1
NetU7_35: U8.10(BIN2) ; port BIN2

### Notes on the sheet
- Title:
- Sheet:
- of
- Author:
- Model:
- Document Number:
- Checked by:
- Iss-Rev:
- Approved by:
- Date:
- File name:

### Library data of the parts
C33 = C_10nF_50V_C0G_0603_5: Capacitor; Manufacturer: Murata; Manufacturer Part Number: GRM1885C1H103JA01D; Tolerance (%): 5; Part Number: C_10nF_50V_C0G_0603_5; HelpURL: https://datasheet.octopart.com/GRM1885C1H103JA01D-Murata-datasheet-34231350.pdf; Supplier 1: TME; Supplier Part Number 1: GRM1885C1H103JA01D; Supplier 2: RS Components; Supplier Part Number 2: 144-9032; Supplier 3: Farnell; Supplier Part Number 3: 2456107; Supplier 4: Mouser; Supplier Part Number 4: 81-GRM1885C1H103JA1D; Supplier 5: Digi-Key; Supplier Part Number 5: 490-9666-1-ND
C34 = C_2.2uF_35V_X5R_0603_10: Capacitor; Manufacturer: Murata; Manufacturer Part Number: GRM188R6YA225KA12D; Tolerance (%): 10; Part Number: C_2.2uF_35V_X5R_0603_10; HelpURL: https://datasheet.octopart.com/GRM188R6YA225KA12D-Murata-datasheet-66077095.pdf; Supplier 1: TME; Supplier 2: RS Components; Supplier Part Number 2: 8151358; Supplier 3: Farnell; Supplier Part Number 3: 2611926; Supplier 4: Mouser; Supplier Part Number 4: 81-GRM188R6YA225KA2D; Supplier 5: Digi-Key; Supplier Part Number 5: 490-7204-1-ND
D8 = OL_R_0603_OSR50603C1E: LED_RED; Manufacturer: Optosupply; Part Number: OL_R_0603_OSR50603C1E; Manufacturer Part Number: OSR50603C1E; Supplier 1: TME; Supplier Part Number 1: OSR50603C1E; Supplier 2: RS Components; Supplier 3: Farnell; Supplier 4: Mouser; Supplier 5: Digi-Key
P4 P5 = P_HEADER_1x6_2.54_ANGLE: Header, 6-Pin; Manufacturer: Molex; Part Number: P_HEADER_1x6_2.54_ANGLE; Component Type: Standard; HelpURL: https://datasheet.octopart.com/901210766-Molex-datasheet-8335778.pdf; Manufacturer Part Number: 90121-0766; Supplier 1: TME; Supplier Part Number 1: 90121-0766; Supplier 2: RS Components; Supplier Part Number 2: 3606415; Supplier 3: Farnell; Supplier Part Number 3: 9733477; Supplier 4: Mouser; Supplier Part Number 4: 538-90121-0766; Supplier 5: Digi-Key; Supplier Part Number 5: WM8112-ND
R25 = R_1k_0603_1: as R3 on sheet Power; Part Number: R_1k_0603_1; HelpURL: http://www.farnell.com/datasheets/2310790.pdf?_ga=2.256888843.1690599162.1548417389-1379097396.1542296996&_gac=1.262631934.1547230258.Cj0KCQiAmuHhBRD0ARIsAFWyPwhX8HcvXnM3tA0ZBodZLzDIjH2ZxLpjT5LWo9bad_HPRbU8LfPq44UaAhEwEALw_wcB; Supplier 1: TME; Supplier 2: RS Components; Supplier Part Number 2: 678-9875P; Supplier 3: Farnell; Supplier Part Number 3: 1469740; Supplier 4: Mouser; Supplier Part Number 4: 71-CRCW0603-1.0K-E3; Supplier 5: Digi-Key; Supplier Part Number 5: 541-1.00KHCT-ND
R26 = R_10k_0603_1: as R4 on sheet Power; Part Number: R_10k_0603_1; HelpURL: http://www.tme.eu/pl/Document/622e28308c06d160637f2b14751ba16b/Data%20Sheet%20CRCW_BCe3.pdf; Supplier 1: TME; Supplier Part Number 1: CRCW060310K0FKTABC; Supplier 2: RS Components; Supplier 3: Farnell; Supplier 4: Mouser; Supplier Part Number 4: 667-ERJ-3EKF1002V; Supplier 5: Digi-Key; Supplier Part Number 5: P10KGCT-ND
R27 = R_100k_0603_1: as R6 on sheet Power; Part Number: R_100k_0603_1; HelpURL: http://www.tme.eu/pl/Document/b315665a56acbc42df513c99b390ad98/ROYALOHM-THICKFILM.pdf; Supplier 1: TME; Supplier Part Number 1: SMD0603-100K-1%; Supplier 2: RS Components; Supplier 3: Farnell; Supplier 4: Mouser; Supplier Part Number 4: 667-ERJ-3EKF1003V; Supplier 5: Digi-Key; Supplier Part Number 5: P100KHCT-ND
R28 R29 = R_100m_1206_1: Manufacturer: Panasonic; Manufacturer Part Number: ERJ-8BWFR100V; Voltage: 316mV; Power: 1W; Tolerance: 1%; Part Number: R_100m_1206_1; HelpURL: https://docs-emea.rs-online.com/webdocs/154c/0900766b8154cd36.pdf; Supplier 1: TME; Supplier 2: RS Components; Supplier Part Number 2: 566-058; Supplier 3: Farnell; Supplier Part Number 3: 1577547; Supplier 4: Mouser; Supplier Part Number 4: 667-ERJ-8BWFR100V; Supplier 5: Digi-Key; Supplier Part Number 5: P.10AUDKR-ND
U8 = U_DRV8833PWR: Manufacturer: Texas Instruments; Part Number: U_DRV8833PWR; HelpURL: http://www.ti.com/lit/ds/symlink/drv8833.pdf; Manufacturer Part Number: DRV8833PWR; Supplier 1: TME; Supplier 2: RS Components; Supplier 3: Farnell; Supplier 4: Mouser; Supplier Part Number 4: 595-DRV8833PWR; Supplier 5: Digi-Key; Supplier Part Number 5: 296-40080-1-ND

## Sheet CPU.SchDoc: Motherboard-CPU
size A3; Author: Patryk Bujak; DrawnBy: Patryk Bujak; Revision: 1.0; SheetNumber: 3; SheetTotal: 10
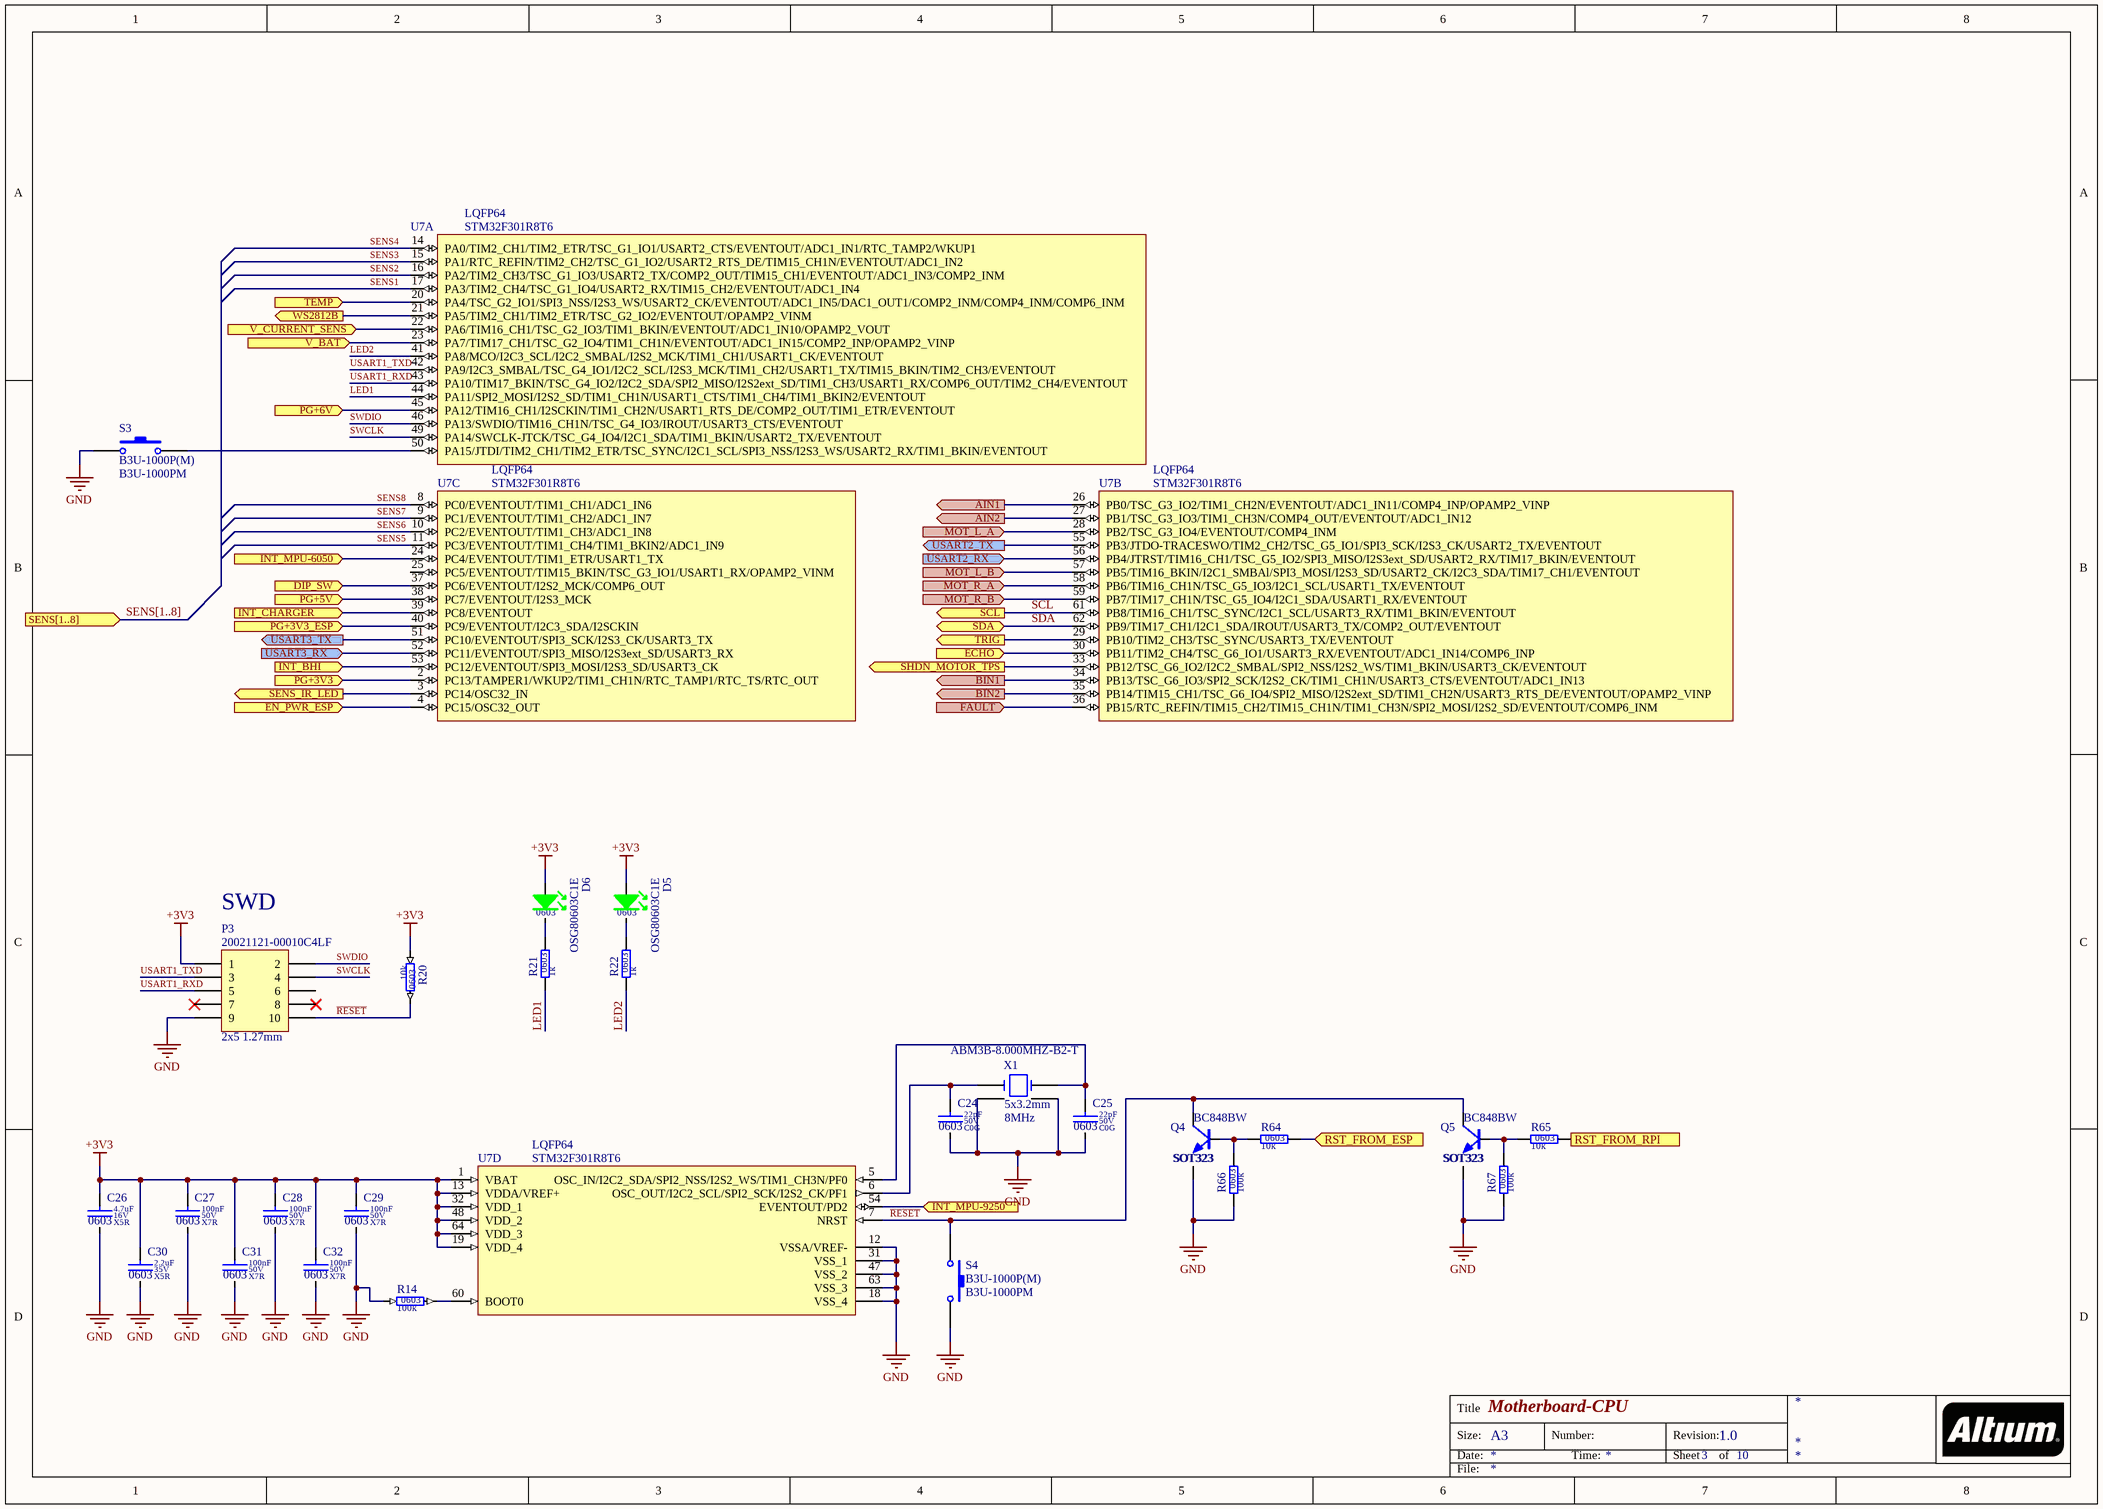
[diagram p4: CPU.SchDoc]

### Parts
C24  value 22pF  Dielectric: C0G  Voltage: 50V  SCH_Footprint: 0603  [C_0603_1608]  (hidden comment: Ceramic C0G)
C25  value 22pF  Dielectric: C0G  Voltage: 50V  SCH_Footprint: 0603  [C_0603_1608]  (hidden comment: Ceramic C0G)
C26  value 4.7uF  Dielectric: X5R  Voltage: 16V  SCH_Footprint: 0603  [C_0603_1608]  (hidden comment: Ceramic X5R)
C27  value 100nF  Dielectric: X7R  Voltage: 50V  SCH_Footprint: 0603  [C_0603_1608]  (hidden comment: Ceramic X7R)
C28  value 100nF  Dielectric: X7R  Voltage: 50V  SCH_Footprint: 0603  [C_0603_1608]  (hidden comment: Ceramic X7R)
C29  value 100nF  Dielectric: X7R  Voltage: 50V  SCH_Footprint: 0603  [C_0603_1608]  (hidden comment: Ceramic X7R)
C30  value 2.2uF  Dielectric: X5R  Voltage: 35V  SCH_Footprint: 0603  [C_0603_1608]  (hidden comment: Ceramic X5R)
C31  value 100nF  Dielectric: X7R  Voltage: 50V  SCH_Footprint: 0603  [C_0603_1608]  (hidden comment: Ceramic X7R)
C32  value 100nF  Dielectric: X7R  Voltage: 50V  SCH_Footprint: 0603  [C_0603_1608]  (hidden comment: Ceramic X7R)
D5  value OSG80603C1E  SCH_Footprint: 0603  [OL_0603_1608]  (hidden comment: Green led)
D6  value OSG80603C1E  SCH_Footprint: 0603  [OL_0603_1608]  (hidden comment: Green led)
P3  value 20021121-00010C4LF  SCH_Footprint: 2x5 1.27mm  [P_HEADER_2x5_1.27]  (hidden comment: Jtag)
Q4  SCH_Footprint: SOT323  [SOT323_SC70]  (hidden comment: BC848BW)
Q5  SCH_Footprint: SOT323  [SOT323_SC70]  (hidden comment: BC848BW)
R14  value 100k  SCH_Footprint: 0603  [R_0603_1608]  (hidden comment: Resistor)
R20  value 10k  SCH_Footprint: 0603  [R_0603_1608]  (hidden comment: Resistor)
R21  value 1k  SCH_Footprint: 0603  [R_0603_1608]  (hidden comment: Resistor)
R22  value 1k  SCH_Footprint: 0603  [R_0603_1608]  (hidden comment: Resistor)
R64  value 10k  SCH_Footprint: 0603  [R_0603_1608]  (hidden comment: Resistor)
R65  value 10k  SCH_Footprint: 0603  [R_0603_1608]  (hidden comment: Resistor)
R66  value 100k  SCH_Footprint: 0603  [R_0603_1608]  (hidden comment: Resistor)
R67  value 100k  SCH_Footprint: 0603  [R_0603_1608]  (hidden comment: Resistor)
S3  value B3U-1000PM  SCH_Footprint: B3U-1000P(M)  [B3U-1000P]  (hidden comment: Ultra-small Tactile Switch)
S4  value B3U-1000PM  SCH_Footprint: B3U-1000P(M)  [B3U-1000P]  (hidden comment: Ultra-small Tactile Switch)
U7  SCH_Footprint: LQFP64  [LQFP64_10x10]  (hidden comment: STM32F301R8T6)  (parts A,B,C,D of 4)
X1  Manufacturer Part Number: ABM3B-8.000MHZ-B2-T  SCH_Footprint: 5x3.2mm  [X_ABM3B_5X3X11]  (hidden comment: 8MHz)

### Ports
AIN1 (out), AIN2 (out), BIN1 (out), BIN2 (out), DIP_SW (in), ECHO (in), EN_PWR_ESP (in), FAULT (in), INT_BHI (in), INT_CHARGER (in), INT_MPU-6050 (in), INT_MPU-9250 (in), MOT_L_A (in), MOT_L_B (in), MOT_R_A (in), MOT_R_B (in), PG+3V3 (in), PG+3V3_ESP (in), PG+5V (in), PG+6V (in), RST_FROM_ESP (in), RST_FROM_RPI (in), SCL (out), SDA (bidir), SENS[1..8] (in), SENS_IR_LED (out), SHDN_MOTOR_TPS (out), TEMP (in), TRIG (out), USART2_RX (in), USART2_TX (out), USART3_RX (in), USART3_TX (out), V_BAT (in), V_CURRENT_SENS (in), WS2812B (out)

### Nets
+3V3: C26.1 C27.1 C28.1 C29.1 C30.1 C31.1 C32.1 D5.2(A) D6.2(A) P3.1 R20.1 U7.1(VBAT) U7.13(VDDA/VREF+) U7.19(VDD_4) U7.32(VDD_1) U7.48(VDD_2) U7.64(VDD_3)
GND: C24.2 C25.2 C26.2 C27.2 C28.2 C29.2 C30.2 C31.2 C32.2 P3.9 Q4.2(E) Q5.2(E) R14.1 R66.1 R67.1 S3.1 S4.2 U7.12(VSSA/VREF-) U7.18(VSS_4) U7.31(VSS_1) U7.47(VSS_2) U7.63(VSS_3) X1.2(GND) X1.4(GND)
LED1: R21.1 U7.44(PA11/SPI2_MOSI/I2S2_SD/TIM1_CH1N/USART1_CTS/TIM1_CH4/TIM1_BKIN2/EVENTOUT)
LED2: R22.1 U7.41(PA8/MCO/I2C3_SCL/I2C2_SMBAL/I2S2_MCK/TIM1_CH1/USART1_CK/EVENTOUT)
PG+3V3: U7.2(PC13/TAMPER1/WKUP2/TIM1_CH1N/RTC_TAMP1/RTC_TS/RTC_OUT) ; port PG+3V3
PG+3V3_ESP: U7.40(PC9/EVENTOUT/I2C3_SDA/I2SCKIN) ; port PG+3V3_ESP
PG+5V: U7.38(PC7/EVENTOUT/I2S3_MCK) ; port PG+5V
PG+6V: U7.45(PA12/TIM16_CH1/I2SCKIN/TIM1_CH2N/USART1_RTS_DE/COMP2_OUT/TIM1_ETR/EVENTOUT) ; port PG+6V
~{RESET}: P3.10 Q4.3(C) Q5.3(C) R20.2 S4.1 U7.7(NRST)
RXD: U7.51(PC10/EVENTOUT/SPI3_SCK/I2S3_CK/USART3_TX) ; port USART3_TX
SCL: U7.61(PB8/TIM16_CH1/TSC_SYNC/I2C1_SCL/USART3_RX/TIM1_BKIN/EVENTOUT) ; port SCL  [project net BCM3/SCL]
SDA: U7.62(PB9/TIM17_CH1/I2C1_SDA/IROUT/USART3_TX/COMP2_OUT/EVENTOUT) ; port SDA  [project net BCM2/SDA]
SENS1: U7.17(PA3/TIM2_CH4/TSC_G1_IO4/USART2_RX/TIM15_CH2/EVENTOUT/ADC1_IN4)
SENS2: U7.16(PA2/TIM2_CH3/TSC_G1_IO3/USART2_TX/COMP2_OUT/TIM15_CH1/EVENTOUT/ADC1_IN3/COMP2_INM)
SENS3: U7.15(PA1/RTC_REFIN/TIM2_CH2/TSC_G1_IO2/USART2_RTS_DE/TIM15_CH1N/EVENTOUT/ADC1_IN2)
SENS4: U7.14(PA0/TIM2_CH1/TIM2_ETR/TSC_G1_IO1/USART2_CTS/EVENTOUT/ADC1_IN1/RTC_TAMP2/WKUP1)
SENS5: U7.11(PC3/EVENTOUT/TIM1_CH4/TIM1_BKIN2/ADC1_IN9)
SENS6: U7.10(PC2/EVENTOUT/TIM1_CH3/ADC1_IN8)
SENS7: U7.9(PC1/EVENTOUT/TIM1_CH2/ADC1_IN7)
SENS8: U7.8(PC0/EVENTOUT/TIM1_CH1/ADC1_IN6)
SWCLK: P3.4 U7.49(PA14/SWCLK-JTCK/TSC_G4_IO4/I2C1_SDA/TIM1_BKIN/USART2_TX/EVENTOUT)
SWDIO: P3.2 U7.46(PA13/SWDIO/TIM16_CH1N/TSC_G4_IO3/IROUT/USART3_CTS/EVENTOUT)
TXD: U7.52(PC11/EVENTOUT/SPI3_MISO/I2S3ext_SD/USART3_RX) ; port USART3_RX
USART1_RXD: P3.5 U7.43(PA10/TIM17_BKIN/TSC_G4_IO2/I2C2_SDA/SPI2_MISO/I2S2ext_SD/TIM1_CH3/USART1_RX/COMP6_OUT/TIM2_CH4/EVENTOUT)
USART1_TXD: P3.3 U7.42(PA9/I2C3_SMBAL/TSC_G4_IO1/I2C2_SCL/I2S3_MCK/TIM1_CH2/USART1_TX/TIM15_BKIN/TIM2_CH3/EVENTOUT)
WS2812B: U7.21(PA5/TIM2_CH1/TIM2_ETR/TSC_G2_IO2/EVENTOUT/OPAMP2_VINM) ; port WS2812B
NetC4_1: U7.20(PA4/TSC_G2_IO1/SPI3_NSS/I2S3_WS/USART2_CK/EVENTOUT/ADC1_IN5/DAC1_OUT1/COMP2_INM/COMP4_INM/COMP6_INM) ; port TEMP
NetC6_1: U7.22(PA6/TIM16_CH1/TSC_G2_IO3/TIM1_BKIN/EVENTOUT/ADC1_IN10/OPAMP2_VOUT) ; port V_CURRENT_SENS
NetC22_1: U7.23(PA7/TIM17_CH1/TSC_G2_IO4/TIM1_CH1N/EVENTOUT/ADC1_IN15/COMP2_INP/OPAMP2_VINP) ; port V_BAT
NetC24_1: C24.1 U7.6(OSC_OUT/I2C2_SCL/SPI2_SCK/I2S2_CK/PF1) X1.3
NetC25_1: C25.1 U7.5(OSC_IN/I2C2_SDA/SPI2_NSS/I2S2_WS/TIM1_CH3N/PF0) X1.1
NetD5_1: D5.1(K) R22.2
NetD6_1: D6.1(K) R21.2
NetD8_1: U7.36(PB15/RTC_REFIN/TIM15_CH2/TIM15_CH1N/TIM1_CH3N/SPI2_MOSI/I2S2_SD/EVENTOUT/COMP6_INM) ; port FAULT
NetJ4_11: U7.3(PC14/OSC32_IN) ; port SENS_IR_LED
NetM1_24: R64.2 ; port RST_FROM_ESP
NetP4_4: U7.28(PB2/TSC_G3_IO4/EVENTOUT/COMP4_INM) ; port MOT_L_A
NetP4_5: U7.57(PB5/TIM16_BKIN/I2C1_SMBAl/SPI3_MOSI/I2S3_SD/USART2_CK/I2C3_SDA/TIM17_CH1/EVENTOUT) ; port MOT_L_B
NetP5_4: U7.58(PB6/TIM16_CH1N/TSC_G5_IO3/I2C1_SCL/USART1_TX/EVENTOUT) ; port MOT_R_A
NetP5_5: U7.59(PB7/TIM17_CH1N/TSC_G5_IO4/I2C1_SDA/USART1_RX/EVENTOUT) ; port MOT_R_B
NetQ4_1: Q4.1(B) R64.1 R66.2
NetQ5_1: Q5.1(B) R65.1 R67.2
NetR7_1: U7.33(PB12/TSC_G6_IO2/I2C2_SMBAL/SPI2_NSS/I2S2_WS/TIM1_BKIN/USART3_CK/EVENTOUT) ; port SHDN_MOTOR_TPS
NetR10_2: R65.2 ; port RST_FROM_RPI
NetR11_2: U7.4(PC15/OSC32_OUT) ; port EN_PWR_ESP
NetR14_2: R14.2 U7.60(BOOT0)
NetR60_1: U7.39(PC8/EVENTOUT) ; port INT_CHARGER
NetS1_7: U7.37(PC6/EVENTOUT/I2S2_MCK/COMP6_OUT) ; port DIP_SW
NetS3_2: S3.2 U7.50(PA15/JTDI/TIM2_CH1/TIM2_ETR/TSC_SYNC/I2C1_SCL/SPI3_NSS/I2S3_WS/USART2_RX/TIM1_BKIN/EVENTOUT)
NetU7_24: U7.24(PC4/EVENTOUT/TIM1_ETR/USART1_TX) ; port INT_MPU-6050
NetU7_26: U7.26(PB0/TSC_G3_IO2/TIM1_CH2N/EVENTOUT/ADC1_IN11/COMP4_INP/OPAMP2_VINP) ; port AIN1
NetU7_27: U7.27(PB1/TSC_G3_IO3/TIM1_CH3N/COMP4_OUT/EVENTOUT/ADC1_IN12) ; port AIN2
NetU7_29: U7.29(PB10/TIM2_CH3/TSC_SYNC/USART3_TX/EVENTOUT) ; port TRIG
NetU7_30: U7.30(PB11/TIM2_CH4/TSC_G6_IO1/USART3_RX/EVENTOUT/ADC1_IN14/COMP6_INP) ; port ECHO
NetU7_34: U7.34(PB13/TSC_G6_IO3/SPI2_SCK/I2S2_CK/TIM1_CH1N/USART3_CTS/EVENTOUT/ADC1_IN13) ; port BIN1
NetU7_35: U7.35(PB14/TIM15_CH1/TSC_G6_IO4/SPI2_MISO/I2S2ext_SD/TIM1_CH2N/USART3_RTS_DE/EVENTOUT/OPAMP2_VINP) ; port BIN2
NetU7_53: U7.53(PC12/EVENTOUT/SPI3_MOSI/I2S3_SD/USART3_CK) ; port INT_BHI
NetU7_54: U7.54(EVENTOUT/PD2) ; port INT_MPU-9250
NetU7_55: U7.55(PB3/JTDO-TRACESWO/TIM2_CH2/TSC_G5_IO1/SPI3_SCK/I2S3_CK/USART2_TX/EVENTOUT) ; port USART2_TX
NetU7_56: U7.56(PB4/JTRST/TIM16_CH1/TSC_G5_IO2/SPI3_MISO/I2S3ext_SD/USART2_RX/TIM17_BKIN/EVENTOUT) ; port USART2_RX

Not connected (* = marked no-connect by the designer): P3 6 7* 8*; U7 25(PC5/EVENTOUT/TIM15_BKIN/TSC_G3_IO1/USART1_RX/OPAMP2_VINM)

### Buses and harness runs
bus SENS[1..8] = port SENS[1..8]

### Notes on the sheet
- (near P3) SWD
- Title
- Size:
- Date:
- A3
- Number:
- Time:
- Revision:
- Sheet
- of
- File:

### Library data of the parts
C24 C25 = C_22pF_50V_C0G_0603_5: Capacitor; Manufacturer: AVX; Manufacturer Part Number: 06035A220JAT2A; Tolerance (%): 5; Part Number: C_22pF_50V_C0G_0603_5; HelpURL: https://datasheet.octopart.com/06035A220JAT2A-AVX-datasheet-9883399.pdf; Supplier 1: TME; Supplier 2: RS Components; Supplier Part Number 2: 1349628; Supplier 3: Farnell; Supplier Part Number 3: 2280861; Supplier 4: Mouser; Supplier Part Number 4: 581-06035A220J; Supplier 5: Digi-Key; Supplier Part Number 5: 478-1167-1-ND
C26 = C_4.7uF_16V_X5R_0603_10: Capacitor; Manufacturer: Murata; Manufacturer Part Number: GRM188R61C475KAAJD; Tolerance (%): 10; Part Number: C_4.7uF_16V_X5R_0603_10; HelpURL: https://datasheet.octopart.com/GRM188R61C475KAAJD-Murata-datasheet-66077093.pdf; Supplier 1: TME; Supplier 2: RS Components; Supplier Part Number 2: 884-7264P; Supplier 3: Farnell; Supplier Part Number 3: 2611924; Supplier 4: Mouser; Supplier Part Number 4: 81-GRM188R61C475KAJD; Supplier 5: Digi-Key; Supplier Part Number 5: 490-10481-2-ND
C27-C29 C31 C32 = C_100nF_50V_X7R_0603_5: as C5 on sheet Power; Part Number: C_100nF_50V_X7R_0603_5; HelpURL: http://www.tme.eu/pl/Document/4a42202b32dab16128fe107dd69598cc/samsung-chip-cap.pdf; Supplier 1: TME; Supplier Part Number 1: CL10B104JB8NNNC; Supplier 2: RS Components; Supplier 3: Farnell; Supplier 4: Mouser; Supplier 5: Digi-Key
C30 = C_2.2uF_35V_X5R_0603_10: as C34 on sheet Motor Driver; Part Number: C_2.2uF_35V_X5R_0603_10; HelpURL: https://datasheet.octopart.com/GRM188R6YA225KA12D-Murata-datasheet-66077095.pdf; Supplier 1: TME; Supplier 2: RS Components; Supplier Part Number 2: 8151358; Supplier 3: Farnell; Supplier Part Number 3: 2611926; Supplier 4: Mouser; Supplier Part Number 4: 81-GRM188R6YA225KA2D; Supplier 5: Digi-Key; Supplier Part Number 5: 490-7204-1-ND
D5 D6 = OL_G_0603_OSG80603C1E: LED GREEN; Manufacturer: Optosupply; Part Number: OL_G_0603_OSG80603C1E; Manufacturer Part Number: OSG80603C1E; Supplier 1: TME; Supplier Part Number 1: OSG80603C1E; Supplier 2: RS Components; Supplier 3: Farnell; Supplier 4: Mouser; Supplier 5: Digi-Key
P3 = P_HEADER_2x5_1.27: Header, 10-Pin, Dual row; Manufacturer: FCI; Part Number: P_HEADER_2x5_1.27; Component Type: Standard; HelpURL: http://www.mouser.com/catalog/645/usd/1591.pdf; Manufacturer Part Number: 20021121-00010C4LF; Supplier 1: TME; Supplier Part Number 1: 20021121-00010C4LF; Supplier 2: RS Components; Supplier Part Number 2: 794-4584; Supplier 3: Farnell; Supplier Part Number 3: 1865279; Supplier 4: Mouser; Supplier Part Number 4: 649-202112100010C4LF; Supplier 5: Digi-Key; Supplier Part Number 5: 609-3695-1-ND
Q4 Q5 = QNP_BC848BW_30V_0A1: Manufacturer: Diotec Semiconductor; Type: NPN; Voltage: 30V; Current: 0A1; Part Number: QNP_BC848BW_30V_0A1; Value: BC848BW; HelpURL: http://www.tme.eu/pl/Document/6f749a16562a2a0770a5550dd3f478bf/bc846w.pdf; Manufacturer Part Number: BC848BW; Supplier 1: TME; Supplier Part Number 1: BC848BW-DIO; Supplier 2: RS Components; Supplier 3: Farnell; Supplier 4: Mouser; Supplier 5: Digi-Key
R14 R66 R67 = R_100k_0603_1: as R6 on sheet Power; Part Number: R_100k_0603_1; HelpURL: http://www.tme.eu/pl/Document/b315665a56acbc42df513c99b390ad98/ROYALOHM-THICKFILM.pdf; Supplier 1: TME; Supplier Part Number 1: SMD0603-100K-1%; Supplier 2: RS Components; Supplier 3: Farnell; Supplier 4: Mouser; Supplier Part Number 4: 667-ERJ-3EKF1003V; Supplier 5: Digi-Key; Supplier Part Number 5: P100KHCT-ND
R20 R64 R65 = R_10k_0603_1: as R4 on sheet Power; Part Number: R_10k_0603_1; HelpURL: http://www.tme.eu/pl/Document/622e28308c06d160637f2b14751ba16b/Data%20Sheet%20CRCW_BCe3.pdf; Supplier 1: TME; Supplier Part Number 1: CRCW060310K0FKTABC; Supplier 2: RS Components; Supplier 3: Farnell; Supplier 4: Mouser; Supplier Part Number 4: 667-ERJ-3EKF1002V; Supplier 5: Digi-Key; Supplier Part Number 5: P10KGCT-ND
R21 R22 = R_1k_0603_1: as R3 on sheet Power; Part Number: R_1k_0603_1; HelpURL: http://www.farnell.com/datasheets/2310790.pdf?_ga=2.256888843.1690599162.1548417389-1379097396.1542296996&_gac=1.262631934.1547230258.Cj0KCQiAmuHhBRD0ARIsAFWyPwhX8HcvXnM3tA0ZBodZLzDIjH2ZxLpjT5LWo9bad_HPRbU8LfPq44UaAhEwEALw_wcB; Supplier 1: TME; Supplier 2: RS Components; Supplier Part Number 2: 678-9875P; Supplier 3: Farnell; Supplier Part Number 3: 1469740; Supplier 4: Mouser; Supplier Part Number 4: 71-CRCW0603-1.0K-E3; Supplier 5: Digi-Key; Supplier Part Number 5: 541-1.00KHCT-ND
S3 S4 = S_B3U-1000PM: Tact Switch; Manufacturer: OMRON; Part Number: S_B3U-1000PM; HelpURL: https://www.tme.eu/Document/abdade7e1ca56d20235b5c747d7227eb/B3U.PDF; Manufacturer Part Number: B3U-1000PM; Supplier 1: TME; Supplier Part Number 1: B3U-1000PM; Supplier 2: RS Components; Supplier 3: Farnell; Supplier 4: Mouser; Supplier Part Number 4: 653-B3U-1000PM; Supplier 5: Digi-Key
U7 = UP_STM32F301R8T6: Manufacturer: STMicroelectronics; Value: STM32F301R8T6; Part Number: UP_STM32F301R8T6; HelpURL: https://www.st.com/resource/en/datasheet/stm32f301c6.pdf; Manufacturer Part Number: STM32F301R8T6; Supplier 1: TME; Supplier 2: RS Components; Supplier 3: Farnell; Supplier Part Number 3: 2424416; Supplier 4: Mouser; Supplier Part Number 4: 511-STM32F301R8T6; Supplier 5: Digi-Key; Supplier Part Number 5: 497-17413-ND
X1 = X_ABM3B-8.000MHZ-B2-T: Manufacturer: Abracon; Part Number: X_ABM3B-8.000MHZ-B2-T; Value: 8MHz; HelpURL: https://datasheet.octopart.com/ABM3B-8.000MHZ-B2-T-Abracon-datasheet-12510201.pdf; Supplier 1: TME; Supplier Part Number 1: ABM3B-8.000MHZ-B2; Supplier 2: RS Components; Supplier Part Number 2: 171-0644; Supplier 3: Farnell; Supplier Part Number 3: 2467818; Supplier 4: Mouser; Supplier Part Number 4: 815-ABM3B-8.0-B2-T; Supplier 5: Digi-Key; Supplier Part Number 5: 535-9720-1-ND